# EAGLE schematic boardFinal (EAGLE 7.4.0)
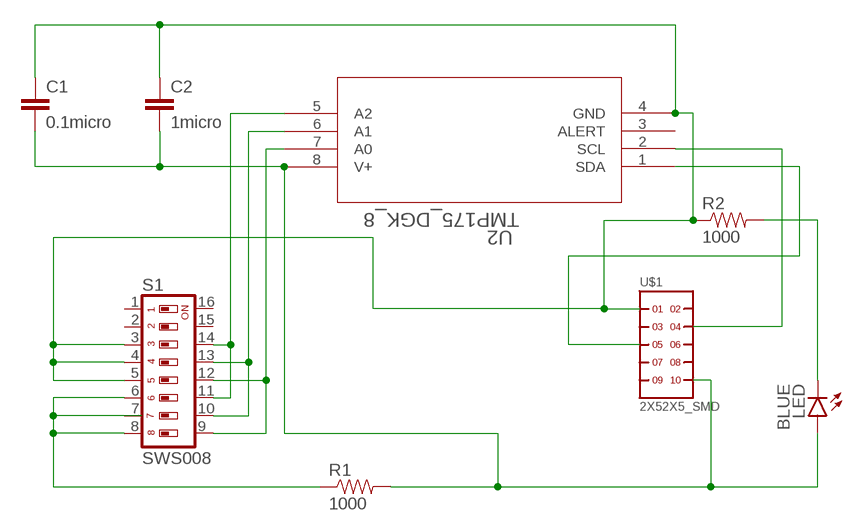
[diagram p0: schematic, sheet 1]

## Parts
C1  0.1micro  22UF-6.3V-20%(0805)  [0805]
C2  1micro  22UF-16V-20%-(1210)  [1210]
LED  BLUE  LED-BLUE1206  [LED-1206]
R1  1000  RESISTOR0805-RES  [0805]
R2  1000  RESISTOR0805-RES  [0805]
S1  SWS008  [SMS-008]
U2  TMP175_DGK_8  [DGK8]
U$1  2X52X5_SMD  [2X5]

## Nets
N$1: C1.2 C2.2 U2.8(V+)
N$2: U2.2(SCL) U$1.P$4
N$3: C1.1 C2.1 R2.1 S1.3 S1.4 S1.5 U2.4(GND) U$1.P$1
N$4: R1.1 S1.6 S1.8
N$5: S1.10 S1.13 U2.6(A1)
N$6: S1.9 S1.12 U2.7(A0)
N$7: S1.11 S1.14 U2.5(A2)
N$9: LED.C R2.2
N$10: LED.A R1.2 U$1.P$10
N$11: U2.1(SDA) U$1.P$5
Unconnected: S1.1 S1.2 S1.7 S1.15 S1.16 U2.3(ALERT) U$1.P$2 U$1.P$3 U$1.P$6 U$1.P$7 U$1.P$8 U$1.P$9

## Library data of the parts
C1 = SparkFun-Capacitors:22UF-6.3V-20%(0805): CAP-08402 Ceramic; PROD_ID: CAP-08402; VALUE: 22uF
C2 = SparkFun-Capacitors:22UF-16V-20%-(1210): CAP-10381; PROD_ID: CAP-10381; VALUE: 22uF
LED = SparkFun-LED:LED-BLUE: Blue LEDs for production use Various blue LEDs stocked by SparkFun production 0603 - DIO-08575 Rebel - DIO-09553 1206 - DIO-09911; PROD_ID: DIO-09911
R1 R2 = SparkFun-Resistors:RESISTOR: Resistor Basic schematic elements and footprints for 0603, 1206, and PTH resistors.
S1 = smd-special:SWS008: SMD Dip Switch 8 pol.
U2 = EagleNew:TMP175_DGK_8; DATASHEETURL: http://www.ti.com/lit/gpn/TMP175; DESCRIPTION: Digital Temperature Sensor with 2-Wire Interface; FAMILY_NAME: TEMPERATURE SENSOR; GENERIC_PART_NUMBER: TMP175; INDUSTRY_STD_PKG_TYPE: MSOP; MANUFACTURER: Texas Instruments; MANUFACTURER_PART_NUMBER: tmp175_dgk_8; PACKAGE_DESIGNATOR: DGK; PIN_COUNT: 8; VENDOR: Texas Instruments
U$1 = headers(2mm)(samtec):2X5

## Net classes
0 default: width 0.025 mm, drill 0.508 mm, clearance 0.254 mm